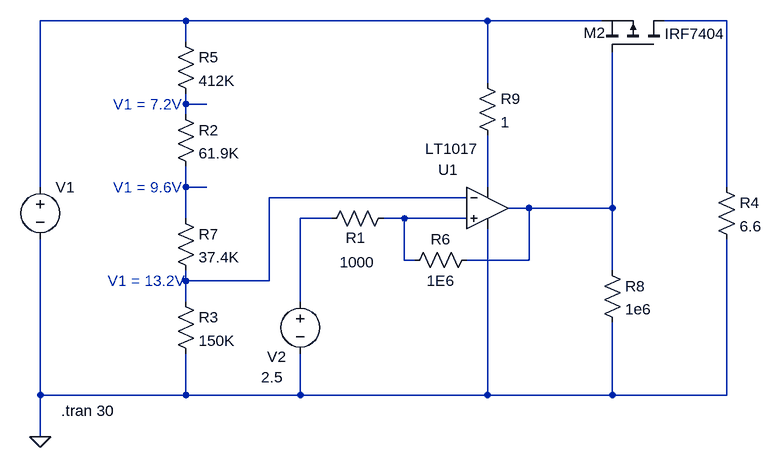
[diagram p0: schematic low voltage cutoff.asc]
low voltage cutoff.asc, the LTspice schematic file:
Version 4
SHEET 1 944 680
WIRE -400 0 -624 0
WIRE 64 0 -400 0
WIRE 240 0 64 0
WIRE 432 0 336 0
WIRE -400 32 -400 0
WIRE 64 96 64 0
WIRE -400 128 -400 112
WIRE -368 128 -400 128
WIRE -400 144 -400 128
WIRE -624 256 -624 0
WIRE -400 256 -400 224
WIRE -368 256 -400 256
WIRE 64 256 64 176
WIRE 432 256 432 0
WIRE 32 272 -272 272
WIRE 128 288 96 288
WIRE 256 288 256 48
WIRE 256 288 128 288
WIRE -400 304 -400 256
WIRE -176 304 -224 304
WIRE -64 304 -96 304
WIRE 32 304 -64 304
WIRE -64 368 -64 304
WIRE -48 368 -64 368
WIRE 128 368 128 288
WIRE 128 368 32 368
WIRE 256 384 256 288
WIRE -400 400 -400 384
WIRE -272 400 -272 272
WIRE -272 400 -400 400
WIRE -400 432 -400 400
WIRE -224 432 -224 304
WIRE -624 576 -624 336
WIRE -400 576 -400 512
WIRE -400 576 -624 576
WIRE -224 576 -224 512
WIRE -224 576 -400 576
WIRE 64 576 64 320
WIRE 64 576 -224 576
WIRE 256 576 256 464
WIRE 256 576 64 576
WIRE 432 576 432 336
WIRE 432 576 256 576
WIRE -624 640 -624 576
FLAG -624 640 0
SYMBOL pmos 336 48 M270
WINDOW 0 30 124 VLeft 0
WINDOW 3 28 -1 VLeft 0
SYMATTR InstName M2
SYMATTR Value IRF7404
SYMBOL voltage -624 240 R0
WINDOW 3 24 104 Invisible 0
WINDOW 123 0 0 Left 0
WINDOW 39 0 0 Left 0
SYMATTR Value PULSE(0 13.2 0 1e-3 5s 1s)
SYMATTR InstName V1
SYMBOL Comparators\\LT1017 64 288 R0
WINDOW 0 -76 -59 Left 0
WINDOW 3 -96 -91 Left 0
SYMATTR InstName U1
SYMBOL res -416 128 R0
SYMATTR InstName R2
SYMATTR Value 61.9K
SYMBOL res -416 416 R0
SYMATTR InstName R3
SYMATTR Value 150K
SYMBOL voltage -224 416 R0
WINDOW 0 -51 101 Left 0
WINDOW 3 -60 132 Left 0
WINDOW 123 0 0 Left 0
WINDOW 39 0 0 Left 0
SYMATTR InstName V2
SYMATTR Value 2.5
SYMBOL res 416 240 R0
SYMATTR InstName R4
SYMATTR Value 6.6
SYMBOL res -80 288 R90
WINDOW 0 61 59 VBottom 0
WINDOW 3 68 56 VTop 0
SYMATTR InstName R1
SYMATTR Value 1000
SYMBOL res 48 352 R90
WINDOW 0 0 56 VBottom 0
WINDOW 3 32 56 VTop 0
SYMATTR InstName R6
SYMATTR Value 1E6
SYMBOL res -416 16 R0
SYMATTR InstName R5
SYMATTR Value 412K
SYMBOL res -416 288 R0
SYMATTR InstName R7
SYMATTR Value 37.4K
SYMBOL res 240 368 R0
SYMATTR InstName R8
SYMATTR Value 1e6
SYMBOL res 48 80 R0
SYMATTR InstName R9
SYMATTR Value 1
TEXT -592 600 Left 0 !.tran 30
TEXT -520 400 Left 0 ;V1 = 13.2V
TEXT -512 256 Left 0 ;V1 = 9.6V
TEXT -512 128 Left 0 ;V1 = 7.2V

The netlist it stands for:
* low voltage cutoff.asc
M2 N002 N007 N001 N001 IRF7404
V1 N001 0 PULSE(0 13.2 0 1e-3 5s 1s)
XU1 N009 N006 N005 0 N007 LT1017  ; pins In+ In- V+ V- OUT
R2 N003 N004 61.9K
R3 N006 0 150K
V2 N008 0 2.5
R4 N002 0 6.6
R1 N009 N008 1000
R6 N007 N009 1E6
R5 N001 N003 412K
R7 N004 N006 37.4K
R8 N007 0 1e6
R9 N001 N005 1
.model NMOS NMOS
.model PMOS PMOS
.lib standard.mos
.tran 30
* V1 = 13.2V
* V1 = 9.6V
* V1 = 7.2V
.backanno
.end